# EasyEDA Pro project ProPrj_FYP_Final_Rigid.epro

# Schematic RC_LPF
Board Name: RC_LPF; Create Date: 2026-06-03; Page Name: P1; Project Name: FYP_Final_Rigid; Schematic Name: RC_LPF; Update Date: 2026-06-03; Company: EasyEDA.com; Page Size: A4; Version: V1.0
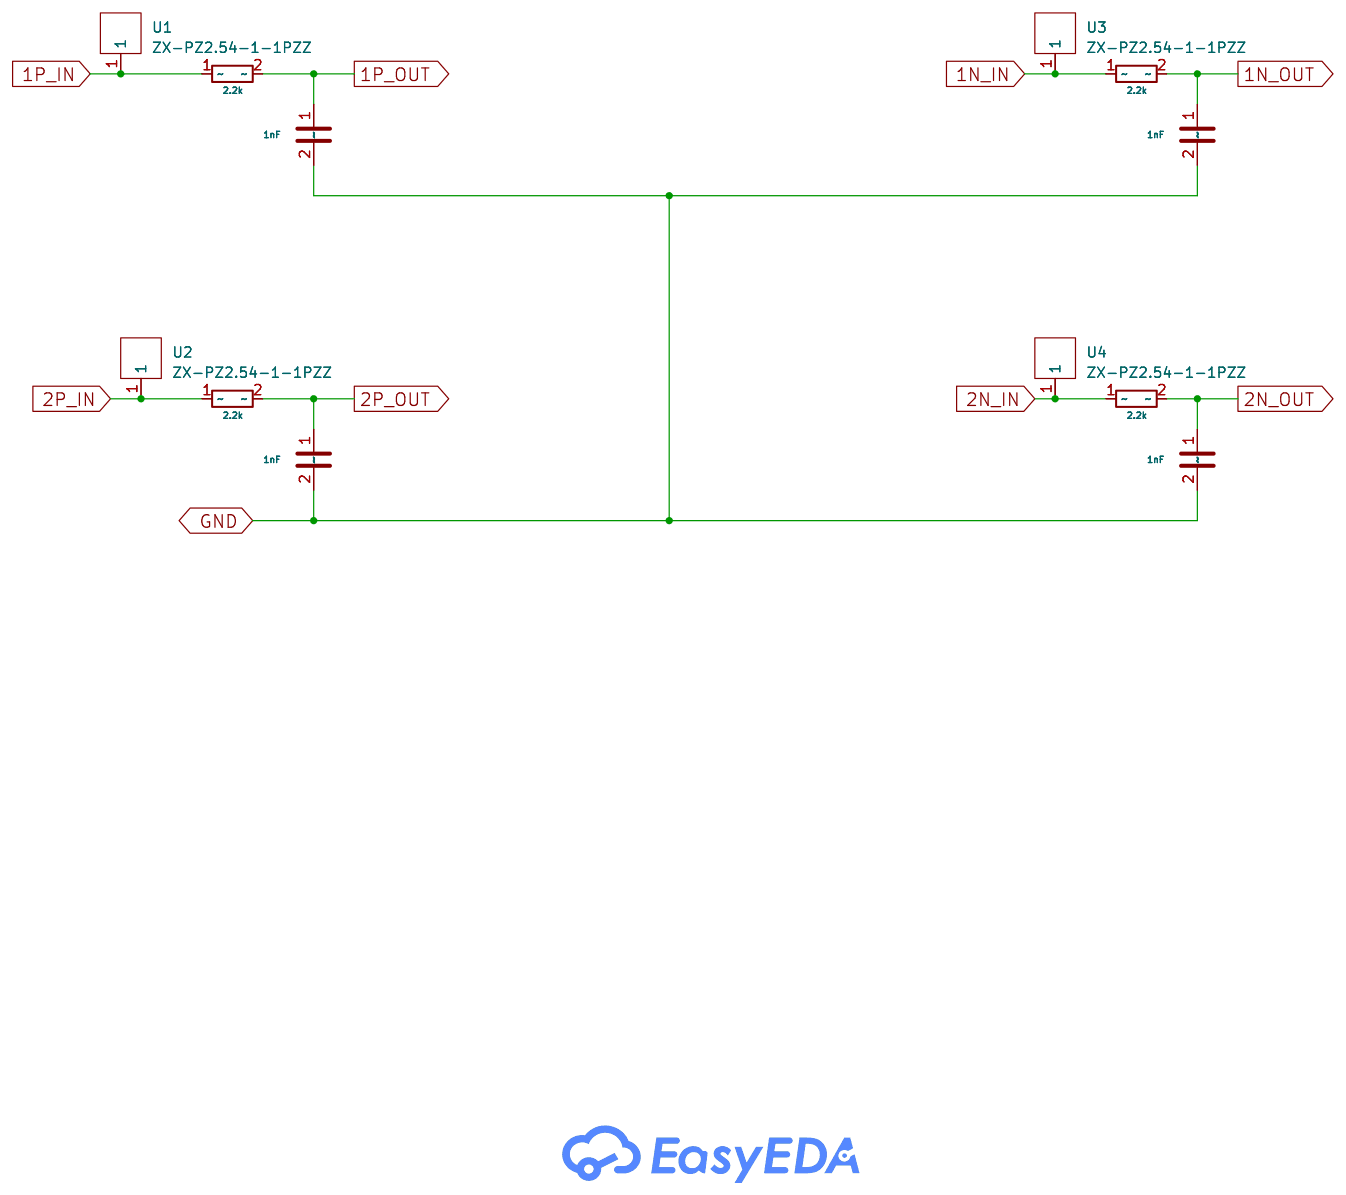
[diagram p0: schematic sheet]

## Parts
C24  1nF  [Capacitor_SMD:C_0805_2012Metric]
C25  1nF  [Capacitor_SMD:C_0805_2012Metric]
C26  1nF  [Capacitor_SMD:C_0805_2012Metric]
C27  1nF  [Capacitor_SMD:C_0805_2012Metric]
R27  2.2k  [R0402]
R34  2.2k  [R0402]
R35  2.2k  [R0402]
R36  2.2k  [R0402]
U1  ZX-PZ2.54-1-1PZZ  [HDR-TH_1P-P2.54-V-M]
U2  ZX-PZ2.54-1-1PZZ  [HDR-TH_1P-P2.54-V-M]
U3  ZX-PZ2.54-1-1PZZ  [HDR-TH_1P-P2.54-V-M]
U4  ZX-PZ2.54-1-1PZZ  [HDR-TH_1P-P2.54-V-M]

## Library data of the parts
C24-C27 = Device_C: Attribute1: C3
R27 R34-R36 = Device_R: Attribute1: R16
U1-U4 = ZX-PZ2.54-1-1PZZ: Pin Structure:1x1P Pitch:2.54mm Row Spacing:- Circluar Pins/Square Pins:Pin Header Mounting Type:Through Hole Number of Rows:1 Number of Pins:1P Current Rating:3A Voltage Rating (Max):- Length of Mating Pin:6mm Insulation Height:2.5mm Length of End Connec; LCSC Part Name: 1x1P 间距:2.54mm 方针 直插; Supplier Part: C7501259; Manufacturer: Megastar(兆星); Supplier Footprint: 插件,P=2.54mm; JLCPCB Part Class: Extended Part; Datasheet: https://item.szlcsc.com/datasheet/ZX-PZ2.54-1-1PZZ/8582472.html; Supplier: LCSC; Pin Structure: 1x1P; Pitch: 2.54mm; Circluar Pins/Square Pins: Pin Header; Mounting Type: Through Hole; Number of Rows: 1; Number of Pins: 1P; Current Rating: 3A; Length of Mating Pin: 6mm; Insulation Height: 2.5mm; Length of End Connection Pin: 3mm; Contact Material: Brass; Contact Plating: Gold; Operating Temperature: -40℃~+105℃; Color: Black

## Nets
GND: C24.2 C25.2 C26.2 C27.2
1N_IN: R34.1 U3.1
1N_OUT: C25.1 R34.2
1P_IN: R27.1 U1.1
1P_OUT: C24.1 R27.2
2N_IN: R36.1 U4.1
2N_OUT: C27.1 R36.2
2P_IN: R35.1 U2.1
2P_OUT: C26.1 R35.2

# Schematic Schematic1
Board Name: Board1; Create Date: 2026-06-03; Page Name: Main; Project Name: FYP_Final_Rigid; Schematic Name: Schematic1; Update Date: 2026-06-03; Company: EasyEDA.com; Page Size: A4; Version: V1.0
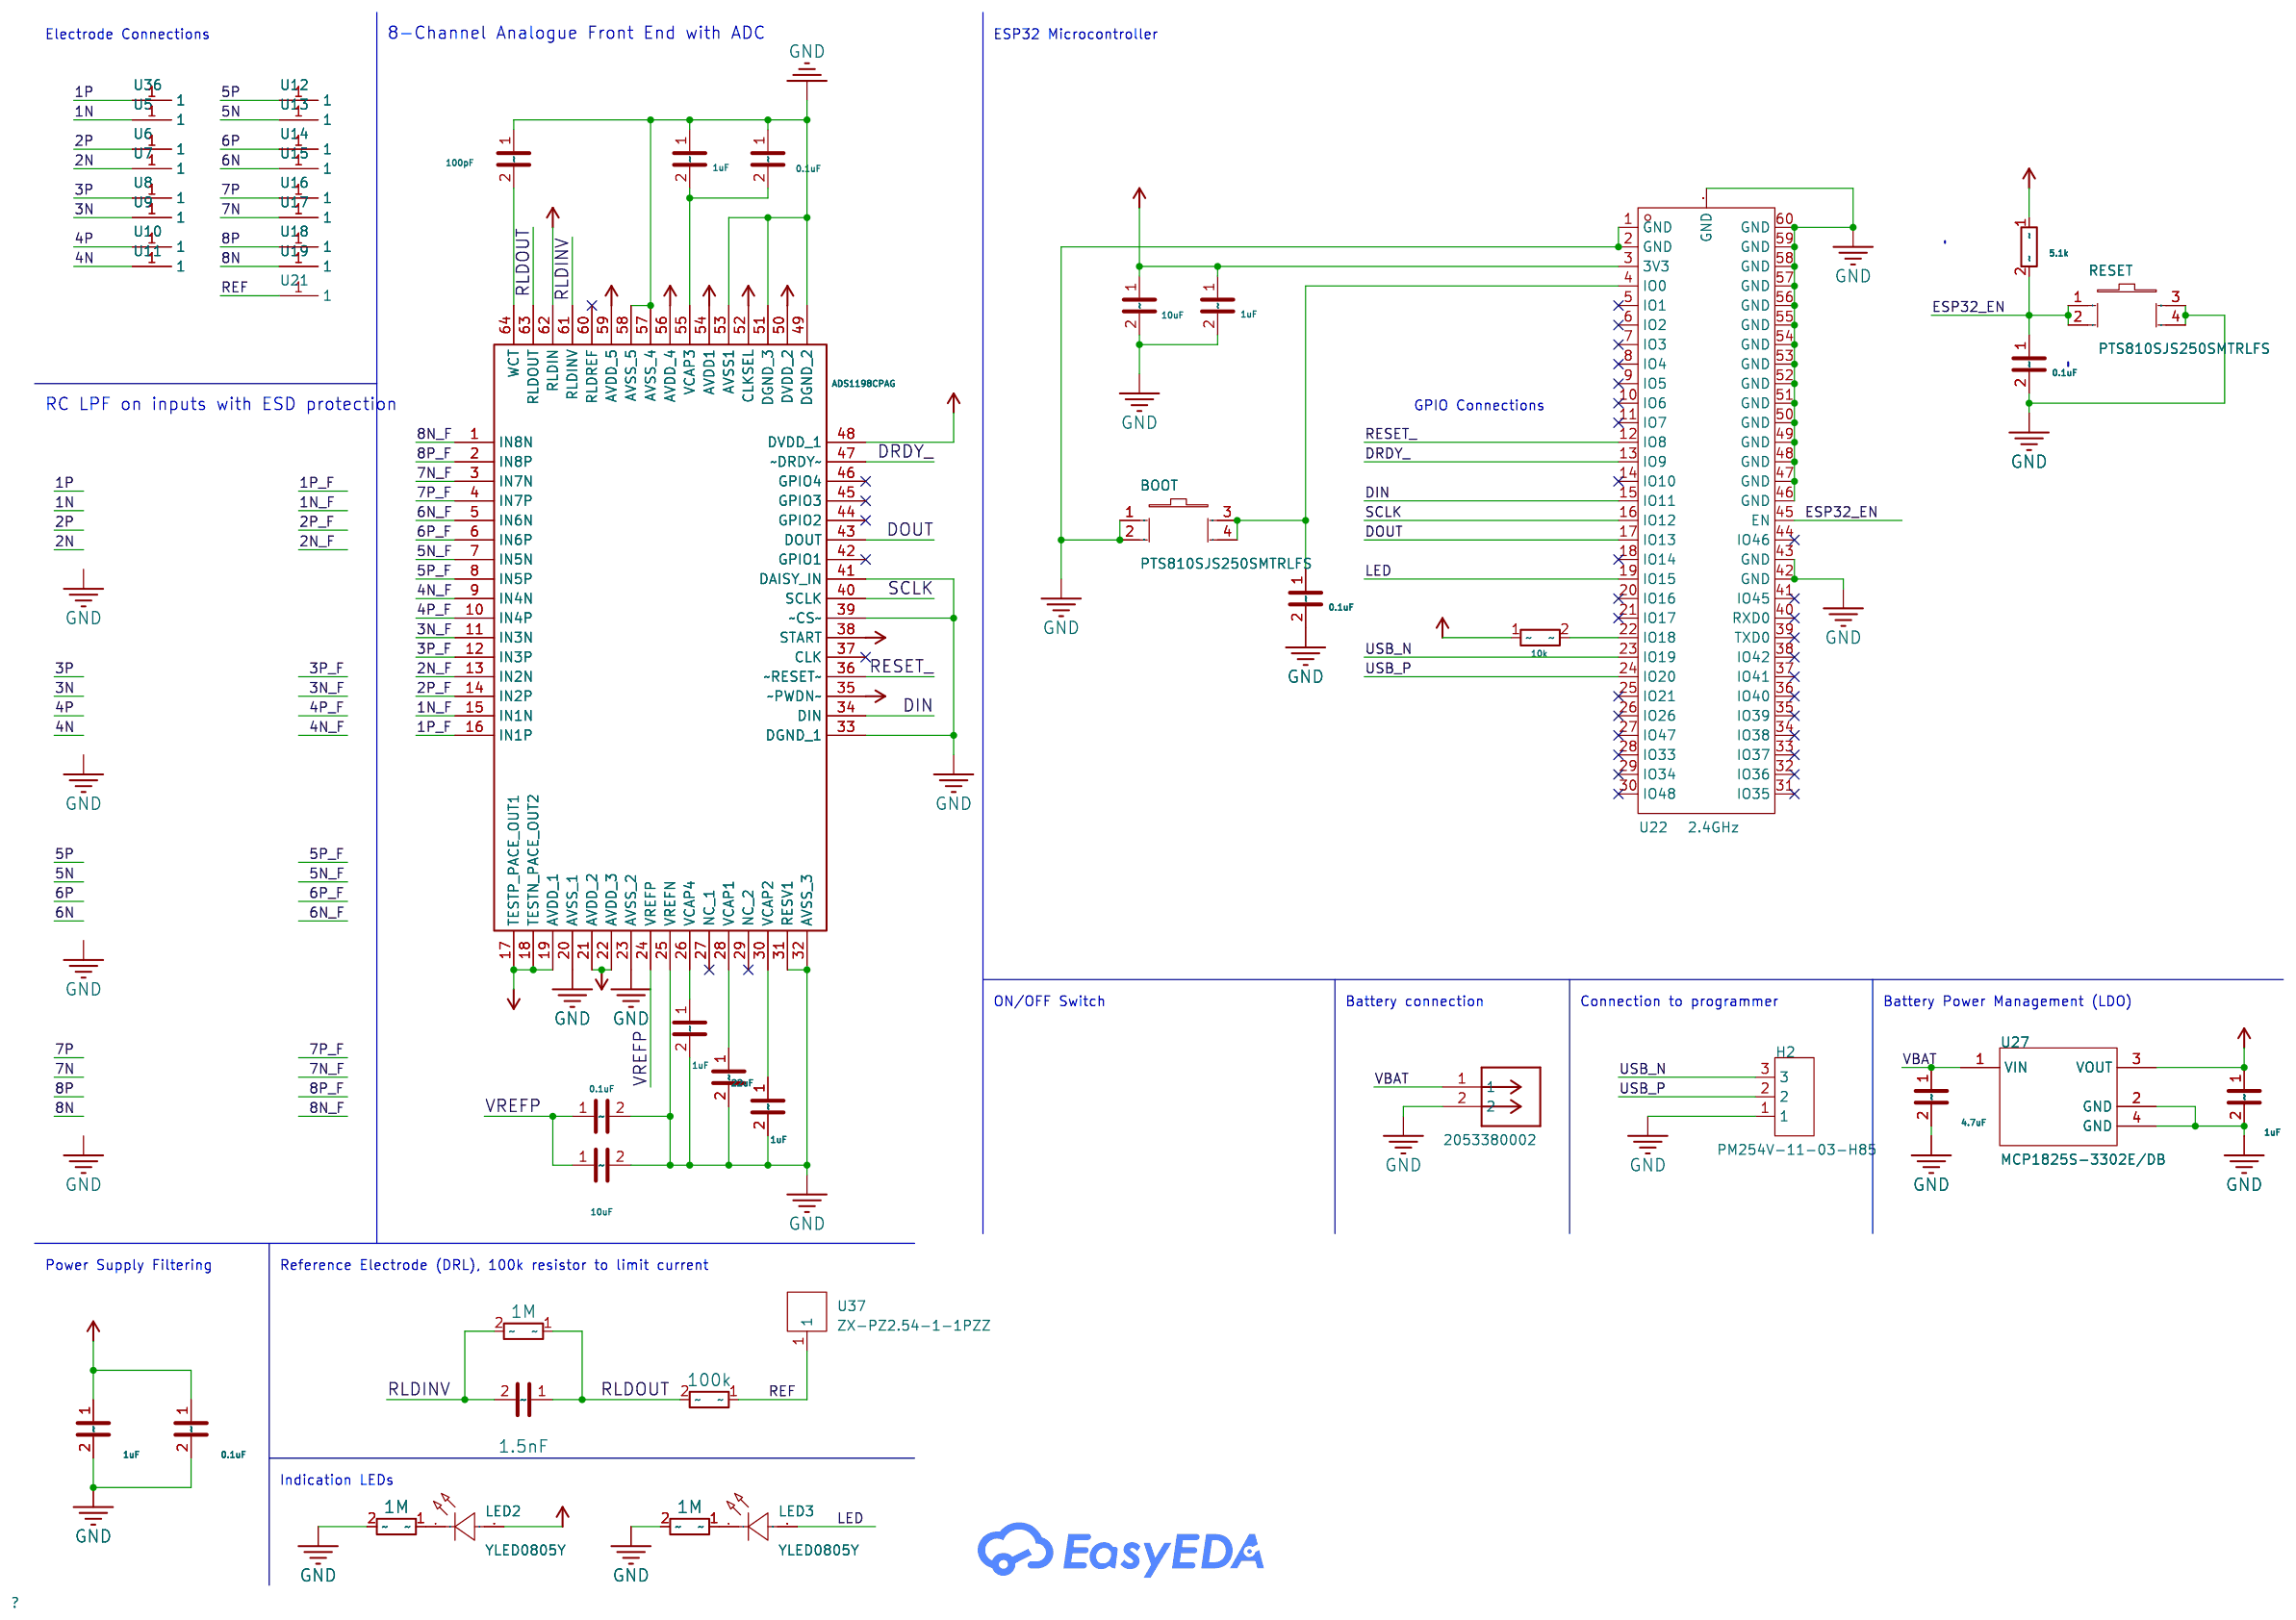
[diagram p1: schematic sheet]

## Parts
BOOT  PTS810SJS250SMTRLFS  [SW-SMD_4P_PTS810SJM250SMTRLFS]
C3  1uF  [Capacitor_SMD:C_0805_2012Metric]
C5  1.5nF  [Capacitor_SMD:C_0805_2012Metric]
C6  100pF  [Capacitor_SMD:C_0805_2012Metric]
C7  0.1uF  [Capacitor_SMD:C_0805_2012Metric]
C8  10uF  [Capacitor_SMD:C_0805_2012Metric]
C9  1uF  [Capacitor_SMD:C_0805_2012Metric]
C10  1uF  [Capacitor_SMD:C_0805_2012Metric]
C11  22uF  [Capacitor_SMD:C_0805_2012Metric]
C12  1uF  [Capacitor_SMD:C_0805_2012Metric]
C18  0.1uF  [Capacitor_SMD:C_0805_2012Metric]
C20  0.1uF  [Capacitor_SMD:C_0805_2012Metric]
C22  0.1uF  [Capacitor_SMD:C_0805_2012Metric]
C23  10uF  [Capacitor_SMD:C_0805_2012Metric]
C28  1uF  [Capacitor_SMD:C_0805_2012Metric]
C29  0.1uF  [Capacitor_SMD:C_0805_2012Metric]
C35  1uF  [Capacitor_SMD:C_0805_2012Metric]
C36  4.7uF  [Capacitor_SMD:C_0805_2012Metric]
CBB1  -
CBB2  -
CBB3  -
CBB4  -
H2  PM254V-11-03-H85  [HDR-TH_3P-P2.54-V-F]
IC2  ADS1198CPAG  [ADS1198CPAG:QFP50P1200X1200X120-64N]
LED2  YLED0805Y  [LED0805-RD_YELLOW]
LED3  YLED0805Y  [LED0805-RD_YELLOW]
R7  1M  [Resistor_SMD:R_0805_2012Metric]
R22  5.1k  [Resistor_SMD:R_0805_2012Metric]
R26  10k  [Resistor_SMD:R_0805_2012Metric]
R37  100k  [Resistor_SMD:R_0805_2012Metric]
R42  1M  [Resistor_SMD:R_0805_2012Metric]
R44  1M  [Resistor_SMD:R_0805_2012Metric]
RESET  PTS810SJS250SMTRLFS  [SW-SMD_4P_PTS810SJM250SMTRLFS]
U5  -  [Electrode_Contact]  (no BOM)
U6  -  [Electrode_Contact]  (no BOM)
U7  -  [Electrode_Contact]  (no BOM)
U8  -  [Electrode_Contact]  (no BOM)
U9  -  [Electrode_Contact]  (no BOM)
U10  -  [Electrode_Contact]  (no BOM)
U11  -  [Electrode_Contact]  (no BOM)
U12  -  [Electrode_Contact]  (no BOM)
U13  -  [Electrode_Contact]  (no BOM)
U14  -  [Electrode_Contact]  (no BOM)
U15  -  [Electrode_Contact]  (no BOM)
U16  -  [Electrode_Contact]  (no BOM)
U17  -  [Electrode_Contact]  (no BOM)
U18  -  [Electrode_Contact]  (no BOM)
U19  -  [Electrode_Contact]  (no BOM)
U20  2053380002  [CONN_2053380000-SD_02_MOL]
U21  -  [Electrode_Contact]  (no BOM)
U22  2.4GHz  [BULETM-SMD_ESP32-S3-MINI-1-N8]
U27  MCP1825S-3302E/DB  [SOT-223-3_L6.5-W3.4-P2.30-LS7.0-BR]
U36  -  [Electrode_Contact]  (no BOM)
U37  ZX-PZ2.54-1-1PZZ  [HDR-TH_1P-P2.54-V-M]

## Library data of the parts
BOOT RESET = PTS810SJS250SMTRLFS: Circuit:SPST Actuator Style:Round Button Operating Force:6N Mounting Type:Surface Mount,Vertical Length:4.2mm Width:3.2mm Switch Height:2.5mm Contact Current:50mA Voltage Rating:16V With Lamp:- Termination Style:J-Lead Life:- Operating Temperature:-40℃~+8; LCSC Part Name: 轻触开关4.2mm*3.2mm，600gf; Supplier Part: C221897; Manufacturer: C&K; Supplier Footprint: SMD-4P,3.2x4.2mm; JLCPCB Part Class: Extended Part; Datasheet: https://item.szlcsc.com/datasheet/PTS810SJS250SMTRLFS/222327.html; Supplier: LCSC; Circuit: SPST; Actuator Style: Round Button; Operating Force: 6N; Mounting Type: Surface Mount,Vertical; Length: 4.2mm; Width: 3.2mm; Switch Height: 2.5mm; Contact Current: 50mA; Voltage Rating: 16V; Termination Style: J-Lead; Operating Temperature: -40℃~+85℃
C3 = Device_C
C5-C12 C20 C22 C28 C29 C35 C36 = Device_C: Attribute1: C3
C18 C23 = Device_C: Unpolarized capacitor; Attribute1: C3
H2 = PM254V-11-03-H85: Holes Structure:1x3P Pitch:2.54mm Row Spacing:- Circular Hole / Square Hole:Square Hole Mounting Type:Through Hole Number of Rows:1 Number of Positions:3P Current Rating:3A Holes Direction:Top Insulation Height:8.5mm Contact Material:Brass Contact Plating; LCSC Part Name: 1x3P 间距:2.54mm 直插; Supplier Part: C541850; Manufacturer: XFCN(兴飞); Supplier Footprint: 插件,P=2.54mm; JLCPCB Part Class: Extended Part; Datasheet: https://item.szlcsc.com/datasheet/PM254V-11-03-H85/562471.html; Supplier: LCSC; Holes Structure: 1x3P; Pitch: 2.54mm; Circular Hole / Square Hole: Square Hole; Mounting Type: Through Hole; Number of Rows: 1; Number of Positions: 3P; Current Rating: 3A; Holes Direction: Top; Insulation Height: 8.5mm; Contact Material: Brass; Operating Temperature: -40℃~+105℃
IC2 = ADS1198CPAG_ADS1198CPAG: Low-Noise, 8 Channel, 16 Bit Analog Front End for ECG/EEG Measurements; Datasheet: http://www.ti.com/lit/gpn/ads1198; Height: 1.2; Mouser Part Number: 595-ADS1198CPAG; Mouser Price/Stock: https://www.mouser.co.uk/ProductDetail/Texas-Instruments/ADS1198CPAG?qs=kdXDfQWUdfeQh%252BqZGyXmmw%3D%3D; Manufacturer_Name: Texas Instruments; User doc link: http://www.ti.com/lit/gpn/ads1198
LED2 LED3 = YLED0805Y: Lamp Holder Type:- Illumination Color:Yellow Voltage - Forward(Vf):1.8V~2.4V Voltage - Forward(Vf):1.8V~2.4V Power(Watts):60mW Forward Current:20mA Wavelength - Dominant:584nm~596nm Wavelength - Dominant:584nm~596nm Peak Wavelength:598nm Peak Wavelength:5; LCSC Part Name: 发光管; Supplier Part: C20608785; Manufacturer: YONGYUTAI(永裕泰); Supplier Footprint: 0805; JLCPCB Part Class: Extended Part; Datasheet: https://item.szlcsc.com/datasheet/YLED0805Y/21958292.html; Supplier: LCSC; Illumination Color: Yellow; Voltage - Forward(Vf): 1.8V~2.4V; Power(Watts): 60mW; Forward Current: 20mA; Wavelength - Dominant: 584nm~596nm; Peak Wavelength: 598nm; Diode Configuration: Discrete Diode; Lens Color: Water Clear; Luminous Intensity: 210mcd; Viewing Angle: 120°; Operating Temperature: -40℃~+85℃
R7 R22 R26 R37 R42 R44 = Device_R: Attribute1: R16
U5-U19 U21 U36 = electrode-contact
U20 = 2053380002
U22 = ESP32-S3-MINI-1-N8: Utilized IC / Part:ESP32-S3FN8 Chip Wireless Standard:Bluetooth5.0 Interface Type:SPI；I2S；USB；I2C；UART Frequency:2.4GHz Antenna Type:On-board PCB Antenna Output Power:20.5dBm Output Power:20.5dBm Voltage - Supply:3V~3.6V Voltage - Supply:3V~3.6V Receive; LCSC Part Name: 不带固件 小尺寸模组，集成2.4GHz Wi-Fi(802.11b/g/n)+Bluetooth 5(LE); Supplier Part: C2913206; Manufacturer: ESPRESSIF(乐鑫); Supplier Footprint: SMD; JLCPCB Part Class: Extended Part; Datasheet: https://item.szlcsc.com/datasheet/ESP32-S3-MINI-1-N8/3198304.html; Supplier: LCSC; Utilized IC / Part: ESP32-S3FN8 Chip; Wireless Standard: Bluetooth5.0; Interface Type: SPI；I2S；USB；I2C；UART; Antenna Type: On-board PCB Antenna; Output Power: 20.5dBm; Voltage - Supply: 3V~3.6V; Receive  Current: 97mA; Send  Current: 330mA; Sensitivity: -104.5dBm; Operating Temperature: -40℃~+85℃
U27 = MCP1825S-3302E/DB: Output Type:Fixed Voltage - Supply:6V Output Voltage:3.3V Output Voltage:3.3V Output Current:500mA Power Supply Rejection Ratio (PSRR):60dB@(100Hz) Voltage Dropout:210mV@(500mA) standby current:120uA Features:Short Circuit Protection；Over Temperature Prot; LCSC Part Name: 输入6V 输出3.3V 500mA; Supplier Part: C148031; Manufacturer: MICROCHIP(美国微芯); Supplier Footprint: SOT-223-3; JLCPCB Part Class: Extended Part; Datasheet: https://item.szlcsc.com/datasheet/MCP1825S-3302E%252FDB/159364.html; Supplier: LCSC; Output Type: Fixed; Voltage - Supply: 6V; Output Voltage: 3.3V; Output Current: 500mA; Power Supply Rejection Ratio (PSRR): 60dB@(100Hz); Voltage Dropout: 210mV@(500mA); standby current: 120uA; Features: Short Circuit Protection；Over Temperature Protection；Over Current Protection；Under Voltage Lockout; Operating Temperature: -40℃~+125℃@(Tj); Output Configuration: Positive; Number of Outputs: 1
U37 = ZX-PZ2.54-1-1PZZ: Pin Structure:1x1P Pitch:2.54mm Row Spacing:- Circluar Pins/Square Pins:Pin Header Mounting Type:Through Hole Number of Rows:1 Number of Pins:1P Current Rating:3A Voltage Rating (Max):- Length of Mating Pin:6mm Insulation Height:2.5mm Length of End Connec; LCSC Part Name: 1x1P 间距:2.54mm 方针 直插; Supplier Part: C7501259; Manufacturer: Megastar(兆星); Supplier Footprint: 插件,P=2.54mm; JLCPCB Part Class: Extended Part; Datasheet: https://item.szlcsc.com/datasheet/ZX-PZ2.54-1-1PZZ/8582472.html; Supplier: LCSC; Pin Structure: 1x1P; Pitch: 2.54mm; Circluar Pins/Square Pins: Pin Header; Mounting Type: Through Hole; Number of Rows: 1; Number of Pins: 1P; Current Rating: 3A; Length of Mating Pin: 6mm; Insulation Height: 2.5mm; Length of End Connection Pin: 3mm; Contact Material: Brass; Contact Plating: Gold; Operating Temperature: -40℃~+105℃; Color: Black

## Nets
GND: BOOT.1 BOOT.2 C3.2 C6.1 C7.2 C8.2 C9.1 C10.2 C11.2 C12.2 C18.1 C20.2 C22.2 C23.2 C28.2 C29.2 C35.2 C36.2 CBB1.5(GND) CBB2.5(GND) CBB3.5(GND) CBB4.5(GND) H2.1 IC2.20(AVSS_1) IC2.23(AVSS_2) IC2.25(VREFN) IC2.31(RESV1) IC2.32(AVSS_3) IC2.33(DGND_1) IC2.39(~CS~) IC2.41(DAISY_IN) IC2.49(DGND_2) IC2.51(DGND_3) IC2.53(AVSS1) IC2.57(AVSS_4) IC2.58(AVSS_5) R42.2 R44.2 RESET.3 RESET.4 U20.2 U22.1(GND) U22.2(GND) U22.42(GND) U22.43(GND) U22.46(GND) U22.47(GND) U22.48(GND) U22.49(GND) U22.50(GND) U22.51(GND) U22.52(GND) U22.53(GND) U22.54(GND) U22.55(GND) U22.56(GND) U22.57(GND) U22.58(GND) U22.59(GND) U22.60(GND) U22.GND U27.2(GND) U27.4(GND)
VBAT: C36.1 U20.1 U27.1(VIN)
1N: CBB1.2(1N_IN) U5.1
1N_F: CBB1.8(1N_OUT) IC2.15(IN1N)
1P: CBB1.1(1P_IN) U36.1
1P_F: CBB1.9(1P_OUT) IC2.16(IN1P)
2N: CBB1.4(2N_IN) U7.1
2N_F: CBB1.6(2N_OUT) IC2.13(IN2N)
2P: CBB1.3(2P_IN) U6.1
2P_F: CBB1.7(2P_OUT) IC2.14(IN2P)
3N: CBB2.2(1N_IN) U9.1
3N_F: CBB2.8(1N_OUT) IC2.11(IN3N)
3P: CBB2.1(1P_IN) U8.1
3P_F: CBB2.9(1P_OUT) IC2.12(IN3P)
4N: CBB2.4(2N_IN) U11.1
4N_F: CBB2.6(2N_OUT) IC2.9(IN4N)
4P: CBB2.3(2P_IN) U10.1
4P_F: CBB2.7(2P_OUT) IC2.10(IN4P)
5N: CBB3.2(1N_IN) U13.1
5N_F: CBB3.8(1N_OUT) IC2.7(IN5N)
5P: CBB3.1(1P_IN) U12.1
5P_F: CBB3.9(1P_OUT) IC2.8(IN5P)
6N: CBB3.4(2N_IN) U15.1
6N_F: CBB3.6(2N_OUT) IC2.5(IN6N)
6P: CBB3.3(2P_IN) U14.1
6P_F: CBB3.7(2P_OUT) IC2.6(IN6P)
7N: CBB4.2(1N_IN) U17.1
7N_F: CBB4.8(1N_OUT) IC2.3(IN7N)
7P: CBB4.1(1P_IN) U16.1
7P_F: CBB4.9(1P_OUT) IC2.4(IN7P)
8N: CBB4.4(2N_IN) U19.1
8N_F: CBB4.6(2N_OUT) IC2.1(IN8N)
8P: CBB4.3(2P_IN) U18.1
8P_F: CBB4.7(2P_OUT) IC2.2(IN8P)
DIN: IC2.34(DIN) U22.15(IO11)
DOUT: IC2.43(DOUT) U22.17(IO13)
DRDY_: IC2.47(~DRDY~) U22.13(IO9)
ESP32_EN: C20.1 R22.2 RESET.1 RESET.2 U22.45(EN)
LED: LED3.2(A) U22.19(IO15)
POWER_+3.3V: C3.1 C23.1 C28.1 C29.1 C35.1 IC2.17(TESTP_PACE_OUT1) IC2.18(TESTN_PACE_OUT2) IC2.19(AVDD_1) IC2.21(AVDD_2) IC2.22(AVDD_3) IC2.35(~PWDN~) IC2.38(START) IC2.48(DVDD_1) IC2.50(DVDD_2) IC2.52(CLKSEL) IC2.54(AVDD1) IC2.56(AVDD_4) IC2.59(AVDD_5) IC2.62(RLDIN) LED2.2(A) R22.1 R26.1 U22.3(3V3) U27.3(VOUT)
REF: R37.1 U21.1 U37.1
RESET_: IC2.36(~RESET~) U22.12(IO8)
RLDINV: C5.2 IC2.61(RLDINV) R7.2
RLDOUT: C5.1 IC2.63(RLDOUT) R7.1 R37.2
SCLK: IC2.40(SCLK) U22.16(IO12)
USB_N: H2.3 U22.23(IO19)
USB_P: H2.2 U22.24(IO20)
VREFP: C7.1 C8.1 IC2.24(VREFP)
$1N2733: C12.1 IC2.30(VCAP2)
$1N2742: C11.1 IC2.28(VCAP1)
$1N2744: C9.2 C18.2 IC2.55(VCAP3)
$1N2800: C6.2 IC2.64(WCT)
$1N2847: C10.1 IC2.26(VCAP4)
$1N15781: BOOT.3 BOOT.4 C22.1 U22.4(IO0)
$1N16915: R26.2 U22.22(IO18)
$1N37471: LED3.1(K) R42.1
$1N37498: LED2.1(K) R44.1

Not connected (* = marked no-connect by the designer): IC2 27(NC_1)* 29(NC_2)* 37(CLK)* 42(GPIO1)* 44(GPIO2)* 45(GPIO3)* 46(GPIO4)* 60(RLDREF)*; U22 5(IO1)* 6(IO2)* 7(IO3)* 8(IO4)* 9(IO5)* 10(IO6)* 11(IO7)* 14(IO10)* 18(IO14)* 20(IO16)* 21(IO17)* 25(IO21)* 26(IO26)* 27(IO47)* 28(IO33)* 29(IO34)* 30(IO48)* 31(IO35)* 32(IO36)* 33(IO37)* 34(IO38)* 35(IO39)* 36(IO40)* 37(IO41)* 38(IO42)* 39(TXD0)* 40(RXD0)* 41(IO45)* 44(IO46)*

## Notes on the sheet
- Electrode Connections
- 8-Channel Analogue Front End with ADC
- ESP32 Microcontroller
- RC LPF on inputs with ESD protection
- GPIO Connections
- ON/OFF Switch
- Battery connection
- Connection to programmer
- Battery Power Management (LDO)
- Power Supply Filtering
- Reference Electrode (DRL), 100k resistor to limit current
- Indication LEDs

# Board PCB1
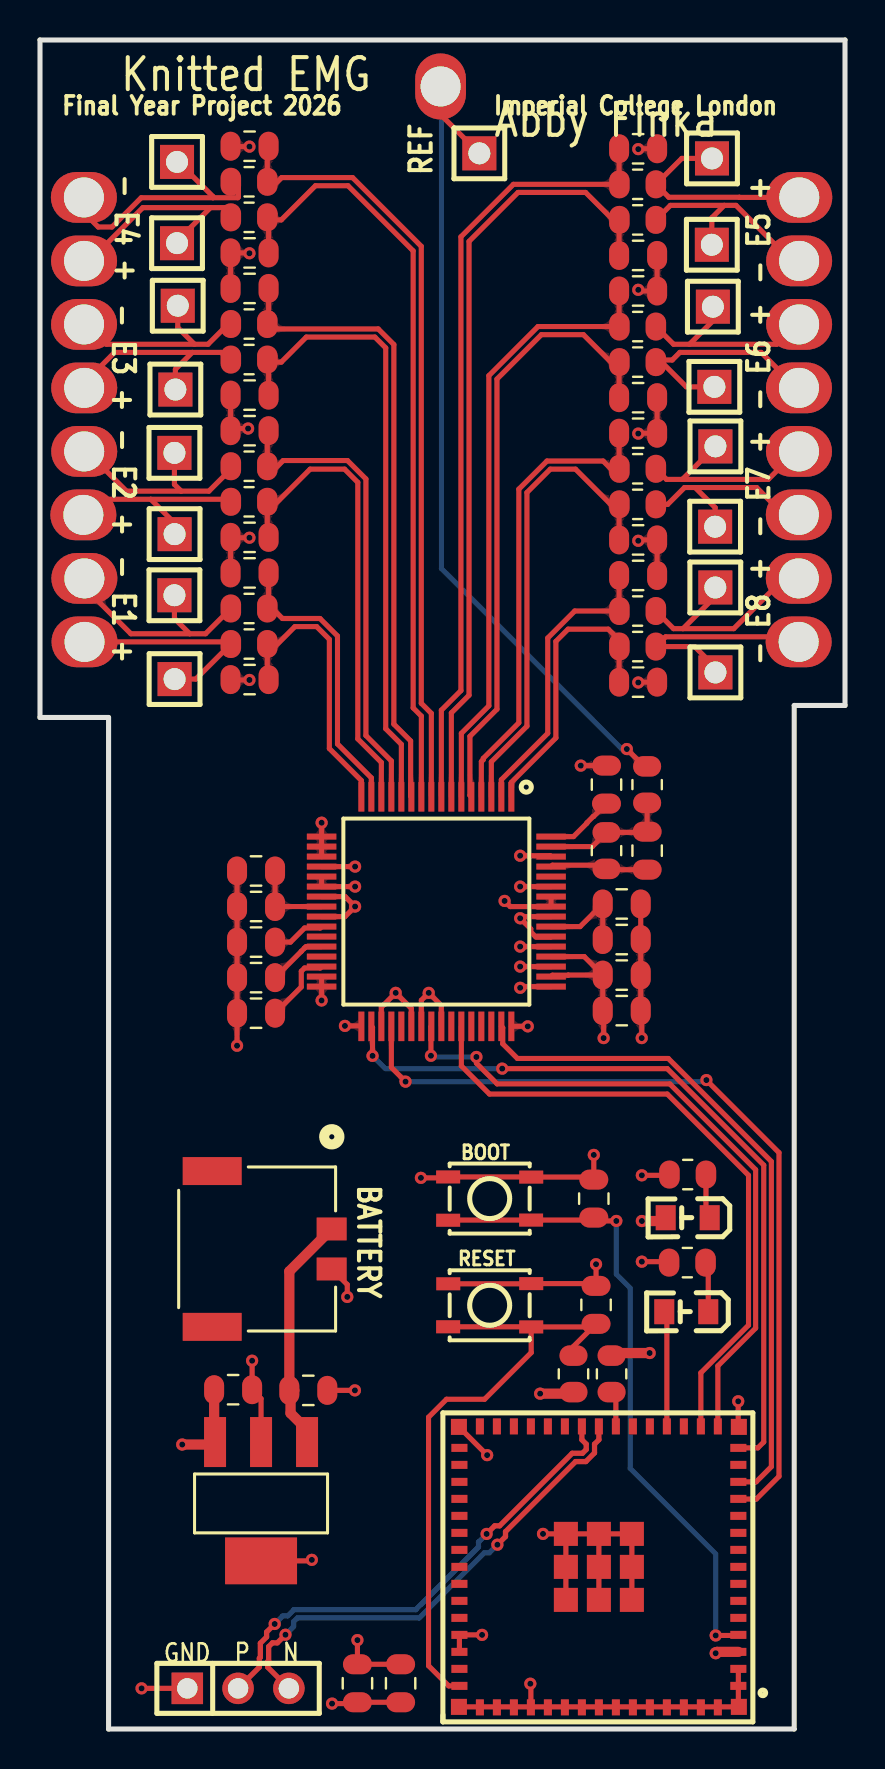
[diagram p2: board, top side]
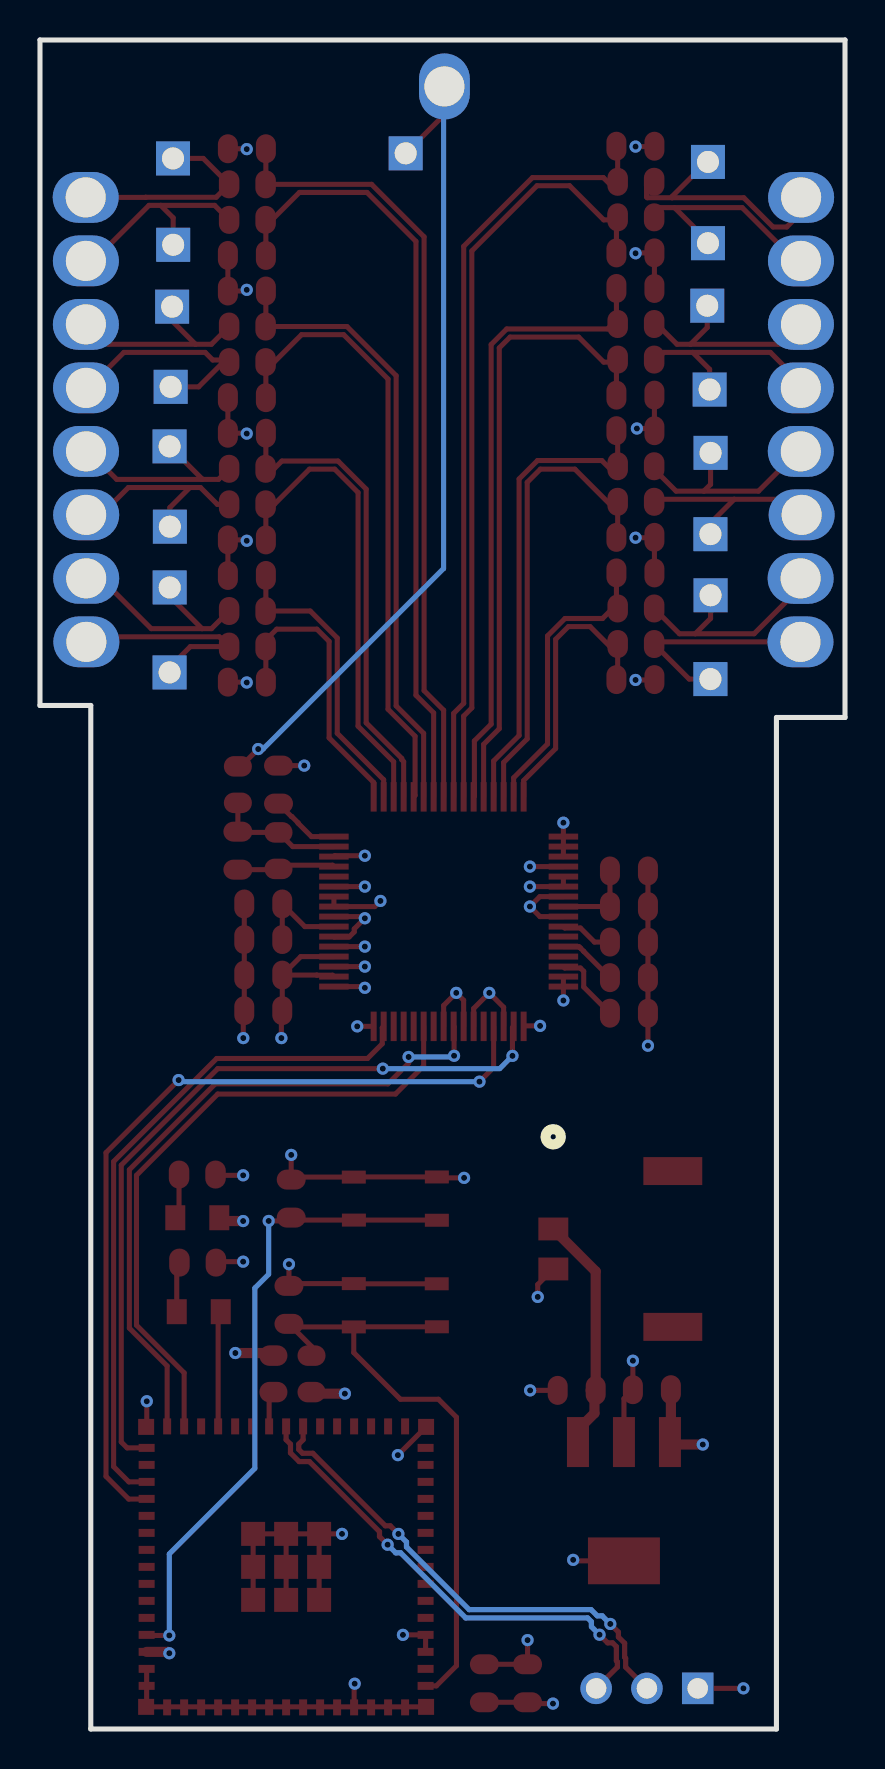
[diagram p3: board, bottom side, seen from below]

Outline 40.26 x 84.45 mm; copper layers: Top Layer, Inner1, Inner2, Bottom Layer. Coordinates in mm from the lower left corner of the outline.
Outline path: 0,84.45 40.26,84.45 40.26,51.18 37.72,51.18 37.72,0 3.43,0 3.43,50.58 0,50.58 0,84.45
Stack: Top Layer 0.035mm Outer layer thickness 1oz / Dielectric1 0.2104mm 7628 RC49% 8.6mil / Inner1 0.0152mm Inner layer thickness / Dielectric2 1.065mm 1.1mm H/HOZ Copper / Inner2 0.0152mm Inner layer thickness / Dielectric3 0.2104mm 7628 RC49% 8.6mil / Bottom Layer 0.035mm Outer layer thickness 1oz

## Design rules (mm)
net 3P_F: DP3
net 3N_F: DP3
net 4P_F: DP4
net 4N_F: DP4
net 5P_F: DP5
net 5N_F: DP5
net 6P_F: DP6
net 6N_F: DP6
net 7P_F: DP7
net 7N_F: DP7
net 1P_F: DP1
net 1N_F: DP1
net 2P_F: DP2
net 2N_F: DP2
net 8P_F: DP8
net 8N_F: DP8
net 1P: 1
net 2P: 2
net 2N: 2
net 1N: 1
net 3P: 3
net 4P: 4
net 4N: 4
net 3N: 3
net 5P: 5
net 6P: 6
net 6N: 6
net 5N: 5
net 7P: 7
net 8P: 8
net 8N: 8
net 7N: 7
net USB_N: USB_
net USB_P: USB_
template: Custom Config
spacing copperThickness1oz (default): track to track 0.102, other pairs 0.152 to 0.3
spacing copperThickness2oz: track to track 0.203, other pairs 0.152 to 0.3
spacing copperThicknessInner0.5oz: track to track 0.089, other pairs 0.152 to 0.3
track width copperThickness1oz (default): min 0.102, default 0.254, max 2.54
track width copperThickness2oz: min 0.203, default 0.254, max 2.54
track width copperThickness0.5oz: min 0.089, default 0.254, max 2.54
differential pair differentialPair (default): width min 0.127, default 0.254, max 2.54; gap min 0.152, default 0.152
differential pair USB: width min 0.261, default 0.261, max 0.261; gap min 0.152, default 0.152
via viaSize (default): diameter min 0.3, default 0.61, max 10; hole min 0.2, default 0.305, max 6.3
diff pair USB_ uses USB

## Placement (name value [footprint] x y rotation side)
BOOT  PTS810SJS250SMTRLFS  [SW-SMD_4P_PTS810SJM250SMTRLFS]  22.49 26.52 0 top
C1  -  [Capacitor_SMD:C_0805_2012Metric]  10.48 66.7 180 top
C2  -  [Capacitor_SMD:C_0805_2012Metric]  10.48 72.03 180 top
C3  1uF  [Capacitor_SMD:C_0805_2012Metric]  15.88 2.29 270 top
C4  -  [Capacitor_SMD:C_0805_2012Metric]  10.48 73.81 180 top
C5  1.5nF  [Capacitor_SMD:C_0805_2012Metric]  30.36 43.92 270 top
C6  100pF  [Capacitor_SMD:C_0805_2012Metric]  28.33 47.22 270 top
C7  0.1uF  [Capacitor_SMD:C_0805_2012Metric]  10.8 42.9 180 top
C8  10uF  [Capacitor_SMD:C_0805_2012Metric]  10.8 41.13 180 top
C9  1uF  [Capacitor_SMD:C_0805_2012Metric]  29.09 41.25 180 top
C10  1uF  [Capacitor_SMD:C_0805_2012Metric]  10.8 39.35 180 top
C11  22uF  [Capacitor_SMD:C_0805_2012Metric]  10.8 37.57 180 top
C12  1uF  [Capacitor_SMD:C_0805_2012Metric]  10.8 35.79 180 top
C13  -  [Capacitor_SMD:C_0805_2012Metric]  10.48 79.14 180 top
C14  -  [Capacitor_SMD:C_0805_2012Metric]  29.91 79.02 0 top
C15  -  [Capacitor_SMD:C_0805_2012Metric]  29.91 73.68 0 top
C16  -  [Capacitor_SMD:C_0805_2012Metric]  29.91 71.9 0 top
C17  -  [Capacitor_SMD:C_0805_2012Metric]  29.91 66.57 0 top
C18  0.1uF  [Capacitor_SMD:C_0805_2012Metric]  29.09 39.48 180 top
C19  -  [Capacitor_SMD:C_0805_2012Metric]  29.91 64.79 0 top
C20  0.1uF  [Capacitor_SMD:C_0805_2012Metric]  27.81 21.21 90 top
C21  -  [Capacitor_SMD:C_0805_2012Metric]  29.91 59.46 0 top
C22  0.1uF  [Capacitor_SMD:C_0805_2012Metric]  27.7 26.52 90 top
C23  10uF  [Capacitor_SMD:C_0805_2012Metric]  18.03 2.29 270 top
C24  -  [Capacitor_SMD:C_0805_2012Metric]  10.48 52.47 180 top
C25  -  [Capacitor_SMD:C_0805_2012Metric]  10.48 57.81 180 top
C26  -  [Capacitor_SMD:C_0805_2012Metric]  10.48 59.59 180 top
C27  -  [Capacitor_SMD:C_0805_2012Metric]  10.48 64.92 180 top
C28  1uF  [Capacitor_SMD:C_0805_2012Metric]  29.09 37.7 0 top
C29  0.1uF  [Capacitor_SMD:C_0805_2012Metric]  29.09 35.92 0 top
C31  -  [Capacitor_SMD:C_0805_2012Metric]  29.91 57.68 0 top
C32  -  [Capacitor_SMD:C_0805_2012Metric]  29.91 52.35 0 top
C35  1uF  [Capacitor_SMD:C_0805_2012Metric]  9.66 16.97 0 top
C36  4.7uF  [Capacitor_SMD:C_0805_2012Metric]  13.42 16.93 0 top
H2  PM254V-11-03-H85  [HDR-TH_3P-P2.54-V-F]  9.91 2.03 0 top
IC2  ADS1198CPAG  [ADS1198CPAG:QFP50P1200X1200X120-64N]  19.82 40.87 270 top
LED2  YLED0805Y  [LED0805-RD_YELLOW]  32.39 25.56 180 top
LED3  YLED0805Y  [LED0805-RD_YELLOW]  32.32 20.87 180 top
R1  -  [Resistor_SMD:R_0805_2012Metric]  10.46 54.25 0 top
R2  -  [Resistor_SMD:R_0805_2012Metric]  10.46 68.48 0 top
R3  -  [Resistor_SMD:R_0805_2012Metric]  10.46 70.25 0 top
R4  -  [Resistor_SMD:R_0805_2012Metric]  10.46 75.59 0 top
R5  -  [Resistor_SMD:R_0805_2012Metric]  10.46 77.37 0 top
R6  -  [Resistor_SMD:R_0805_2012Metric]  29.89 77.24 180 top
R7  1M  [Resistor_SMD:R_0805_2012Metric]  28.33 43.92 270 top
R8  -  [Resistor_SMD:R_0805_2012Metric]  29.89 75.46 180 top
R9  -  [Resistor_SMD:R_0805_2012Metric]  29.89 70.13 180 top
R10  -  [Resistor_SMD:R_0805_2012Metric]  29.89 68.35 180 top
R11  -  [Resistor_SMD:R_0805_2012Metric]  29.89 63.01 180 top
R12  -  [Resistor_SMD:R_0805_2012Metric]  29.89 61.24 180 top
R13  -  [Resistor_SMD:R_0805_2012Metric]  29.89 55.9 180 top
R14  -  [Resistor_SMD:R_0805_2012Metric]  29.89 54.12 180 top
R22  5.1k  [Resistor_SMD:R_0805_2012Metric]  26.68 17.76 90 top
R26  10k  [Resistor_SMD:R_0805_2012Metric]  28.58 17.76 270 top
R34  -  [Resistor_SMD:R_0805_2012Metric]  10.46 56.03 0 top
R35  -  [Resistor_SMD:R_0805_2012Metric]  10.46 61.36 0 top
R36  -  [Resistor_SMD:R_0805_2012Metric]  10.46 63.14 0 top
R37  100k  [Resistor_SMD:R_0805_2012Metric]  30.36 47.22 270 top
R42  1M  [Resistor_SMD:R_0805_2012Metric]  32.37 23.32 180 top
R44  1M  [Resistor_SMD:R_0805_2012Metric]  32.39 27.72 180 top
RESET  PTS810SJS250SMTRLFS  [SW-SMD_4P_PTS810SJM250SMTRLFS]  22.49 21.19 180 top
U1  ZX-PZ2.54-1-1PZZ  [HDR-TH_1P-P2.54-V-M]  6.73 52.5 0 top
U2  ZX-PZ2.54-1-1PZZ  [HDR-TH_1P-P2.54-V-M]  6.73 59.75 0 top
U3  ZX-PZ2.54-1-1PZZ  [HDR-TH_1P-P2.54-V-M]  6.72 56.69 0 top
U4  ZX-PZ2.54-1-1PZZ  [HDR-TH_1P-P2.54-V-M]  6.72 63.81 0 top
U5  -  [Electrode_Contact]  2.22 57.53 270 top
U6  -  [Electrode_Contact]  2.17 60.71 270 top
U7  -  [Electrode_Contact]  2.21 63.88 270 top
U8  -  [Electrode_Contact]  2.21 67.06 270 top
U9  -  [Electrode_Contact]  2.2 70.23 270 top
U10  -  [Electrode_Contact]  2.2 73.41 270 top
U11  -  [Electrode_Contact]  2.2 76.58 270 top
U12  -  [Electrode_Contact]  37.97 76.58 90 top
U13  -  [Electrode_Contact]  37.96 73.41 90 top
U14  -  [Electrode_Contact]  37.96 70.23 90 top
U15  -  [Electrode_Contact]  37.96 67.06 90 top
U16  -  [Electrode_Contact]  37.96 63.88 90 top
U17  -  [Electrode_Contact]  37.95 60.71 90 top
U18  -  [Electrode_Contact]  37.95 57.53 90 top
U19  -  [Electrode_Contact]  37.94 54.36 90 top
U20  2053380002  [CONN_2053380000-SD_02_MOL]  10.86 24 90 top
U21  -  [Electrode_Contact]  20.03 82.13 180 top
U22  2.4GHz  [BULETM-SMD_ESP32-S3-MINI-1-N8]  27.95 8.11 180 top
U23  ZX-PZ2.54-1-1PZZ  [HDR-TH_1P-P2.54-V-M]  6.77 66.98 0 top
U24  ZX-PZ2.54-1-1PZZ  [HDR-TH_1P-P2.54-V-M]  6.85 74.29 0 top
U25  ZX-PZ2.54-1-1PZZ  [HDR-TH_1P-P2.54-V-M]  6.89 71.17 0 top
U26  ZX-PZ2.54-1-1PZZ  [HDR-TH_1P-P2.54-V-M]  6.85 78.36 0 top
U27  MCP1825S-3302E/DB  [SOT-223-3_L6.5-W3.4-P2.30-LS7.0-BR]  11.05 11.38 90 top
U28  ZX-PZ2.54-1-1PZZ  [HDR-TH_1P-P2.54-V-M]  33.61 78.53 0 top
U29  ZX-PZ2.54-1-1PZZ  [HDR-TH_1P-P2.54-V-M]  33.65 71.12 0 top
U30  ZX-PZ2.54-1-1PZZ  [HDR-TH_1P-P2.54-V-M]  33.6 74.22 0 top
U31  ZX-PZ2.54-1-1PZZ  [HDR-TH_1P-P2.54-V-M]  33.73 67.11 0 top
U32  ZX-PZ2.54-1-1PZZ  [HDR-TH_1P-P2.54-V-M]  33.78 64.13 0 top
U33  ZX-PZ2.54-1-1PZZ  [HDR-TH_1P-P2.54-V-M]  33.77 57.08 0 top
U34  ZX-PZ2.54-1-1PZZ  [HDR-TH_1P-P2.54-V-M]  33.76 60.12 0 top
U35  ZX-PZ2.54-1-1PZZ  [HDR-TH_1P-P2.54-V-M]  33.78 52.83 0 top
U36  -  [Electrode_Contact]  2.23 54.36 270 top
U37  ZX-PZ2.54-1-1PZZ  [HDR-TH_1P-P2.54-V-M]  21.97 78.79 0 top

## Footprints (pads in the part's own frame, mm; a bottom-side part is the same pattern mirrored in y, then rotated)
ADS1198CPAG:QFP50P1200X1200X120-64N
  rect 1.475x0.3 smd: 1(-5.738,3.75) 2(-5.738,3.25) 3(-5.738,2.75) 4(-5.738,2.25) 5(-5.738,1.75) 6(-5.738,1.25) 7(-5.738,0.75) 8(-5.738,0.25) 9(-5.738,-0.25) 10(-5.738,-0.75) 11(-5.738,-1.25) 12(-5.738,-1.75) 13(-5.738,-2.25) 14(-5.738,-2.75) 15(-5.738,-3.25) 16(-5.738,-3.75) 33(5.738,-3.75) 34(5.738,-3.25) 35(5.738,-2.75) 36(5.738,-2.25) 37(5.738,-1.75) 38(5.738,-1.25) 39(5.738,-0.75) 40(5.738,-0.25) 41(5.738,0.25) 42(5.738,0.75) 43(5.738,1.25) 44(5.738,1.75) 45(5.738,2.25) 46(5.738,2.75) 47(5.738,3.25) 48(5.738,3.75)
  rect 0.3x1.475 smd: 17(-3.75,-5.738) 18(-3.25,-5.738) 19(-2.75,-5.738) 20(-2.25,-5.738) 21(-1.75,-5.738) 22(-1.25,-5.738) 23(-0.75,-5.738) 24(-0.25,-5.738) 25(0.25,-5.738) 26(0.75,-5.738) 27(1.25,-5.738) 28(1.75,-5.738) 29(2.25,-5.738) 30(2.75,-5.738) 31(3.25,-5.738) 32(3.75,-5.738) 49(3.75,5.738) 50(3.25,5.738) 51(2.75,5.738) 52(2.25,5.738) 53(1.75,5.738) 54(1.25,5.738) 55(0.75,5.738) 56(0.25,5.738) 57(-0.25,5.738) 58(-0.75,5.738) 59(-1.25,5.738) 60(-1.75,5.738) 61(-2.25,5.738) 62(-2.75,5.738) 63(-3.25,5.738) 64(-3.75,5.738)
BULETM-SMD_ESP32-S3-MINI-1-N8
  rect 0.8x0.4 smd: 1(-6.975,5.95) 2(-6.975,5.1) 3(-6.975,4.25) 4(-6.975,3.4) 5(-6.975,2.55) 6(-6.975,1.7) 7(-6.975,0.85) 8(-6.975,0) 9(-6.975,-0.85) 10(-6.975,-1.7) 11(-6.975,-2.55) 12(-6.975,-3.4) 13(-6.975,-4.25) 14(-6.975,-5.1) 15(-6.975,-5.95) 31(6.975,-5.95) 32(6.975,-5.1) 33(6.975,-4.25) 34(6.975,-3.4) 35(6.975,-2.55) 36(6.975,-1.7) 37(6.975,-0.85) 38(6.975,0) 39(6.975,0.85) 40(6.975,1.7) 41(6.975,2.55) 42(6.975,3.4) 43(6.975,4.25) 44(6.975,5.1) 45(6.975,5.95)
  rect 0.4x0.8 smd: 16(-5.95,-7.025) 17(-5.1,-7.025) 18(-4.25,-7.025) 19(-3.4,-7.025) 20(-2.55,-7.025) 21(-1.7,-7.025) 22(-0.85,-7.025) 23(0,-7.025) 24(0.85,-7.025) 25(1.7,-7.025) 26(2.55,-7.025) 27(3.4,-7.025) 28(4.25,-7.025) 29(5.1,-7.025) 30(5.95,-7.025) 46(5.95,7.025) 47(5.1,7.025) 48(4.25,7.025) 49(3.4,7.025) 50(2.55,7.025) 51(1.7,7.025) 52(0.85,7.025) 53(0,7.025) 54(-0.85,7.025) 55(-1.7,7.025) 56(-2.55,7.025) 57(-3.4,7.025) 58(-4.25,7.025) 59(-5.1,7.025) 60(-5.95,7.025)
  rect 0.8x0.8 smd: GND(-7,7) GND(-7,-7) GND(7,7) GND(7,-7)
  rect 1.2x1.2 smd: GND(-1.65,1.65) GND(-1.65,0) GND(-1.65,-1.65) GND(0,1.65) GND(0,0) GND(0,-1.65) GND(1.65,1.65) GND(1.65,0) GND(1.65,-1.65)
Capacitor_SMD:C_0805_2012Metric
  rrect 1x1.45 smd: 1(-0.95,0) 2(0.95,0)
CONN_2053380000-SD_02_MOL
  rect 1.143x1.498 smd: 1(1,-3.728) 2(-1,-3.728)
  rect 1.397x2.946 smd: 3(-3.895,2.248) 4(3.895,2.248)
Electrode_Contact
  rrect 2.54x3.302 hole 2: 1(0,0)
HDR-TH_1P-P2.54-V-M
  rect 1.7x1.7 hole 1.1: 1(0,0)
HDR-TH_3P-P2.54-V-F
  rect 1.575x1.575 hole 1.02: 1(-2.54,0)
  round 1.575 hole 1.02: 2(0,0) 3(2.54,0)
LED0805-RD_YELLOW
  rect 1x1.25 smd: 1(-1.1,0) 2(1.1,0)
Resistor_SMD:R_0805_2012Metric
  rrect 1.025x1.4 smd: 1(-0.912,0) 2(0.912,0)
SOT-223-3_L6.5-W3.4-P2.30-LS7.0-BR
  rect 2.5x1.1 smd: 1(2.97,-2.3) 2(2.97,0) 3(2.97,2.3)
  rect 2.34x3.6 smd: 4(-2.97,0)
SW-SMD_4P_PTS810SJM250SMTRLFS
  rect 1.2x0.65 smd: 1(-2.078,1.083) 2(2.078,1.075) 3(-2.077,-1.083) 4(2.071,-1.075)

## Nets
GND: BOOT.1 BOOT.2 C1.2 C2.2 C3.2 C4.2 C6.1 C7.2 C8.2 C9.1 C10.2 C11.2 C12.2 C13.2 C14.2 C15.2 C16.2 C17.2 C18.1 C19.2 C20.2 C21.2 C22.2 C23.2 C24.2 C25.2 C26.2 C27.2 C28.2 C29.2 C31.2 C32.2 C35.2 C36.2 H2.1 IC2.20 IC2.23 IC2.25 IC2.31 IC2.32 IC2.33 IC2.39 IC2.41 IC2.49 IC2.51 IC2.53 IC2.57 IC2.58 R42.2 R44.2 RESET.3 RESET.4 U20.2 U22.1 U22.2 U22.42 U22.43 U22.46 U22.47 U22.48 U22.49 U22.50 U22.51 U22.52 U22.53 U22.54 U22.55 U22.56 U22.57 U22.58 U22.59 U22.60 U22.GND U27.2 U27.4
VBAT: C36.1 U20.1 U27.1
1N: R34.1 U3.1 U5.1
1N_F: C25.1 IC2.15 R34.2
1P: R1.1 U1.1 U36.1
1P_F: C24.1 IC2.16 R1.2
2N: R36.1 U4.1 U7.1
2N_F: C27.1 IC2.13 R36.2
2P: R35.1 U2.1 U6.1
2P_F: C26.1 IC2.14 R35.2
3N: R3.1 U9.1 U25.1
3N_F: C2.1 IC2.11 R3.2
3P: R2.1 U8.1 U23.1
3P_F: C1.1 IC2.12 R2.2
4N: R5.1 U11.1 U26.1
4N_F: C13.1 IC2.9 R5.2
4P: R4.1 U10.1 U24.1
4P_F: C4.1 IC2.10 R4.2
5N: R8.1 U13.1 U30.1
5N_F: C15.1 IC2.7 R8.2
5P: R6.1 U12.1 U28.1
5P_F: C14.1 IC2.8 R6.2
6N: R10.1 U15.1 U31.1
6N_F: C17.1 IC2.5 R10.2
6P: R9.1 U14.1 U29.1
6P_F: C16.1 IC2.6 R9.2
7N: R12.1 U17.1 U34.1
7N_F: C21.1 IC2.3 R12.2
7P: R11.1 U16.1 U32.1
7P_F: C19.1 IC2.4 R11.2
8N: R14.1 U19.1 U35.1
8N_F: C32.1 IC2.1 R14.2
8P: R13.1 U18.1 U33.1
8P_F: C31.1 IC2.2 R13.2
DIN: IC2.34 U22.15
DOUT: IC2.43 U22.17
DRDY_: IC2.47 U22.13
ESP32_EN: C20.1 R22.2 RESET.1 RESET.2 U22.45
LED: LED3.2 U22.19
POWER_+3.3V: C3.1 C23.1 C28.1 C29.1 C35.1 IC2.17 IC2.18 IC2.19 IC2.21 IC2.22 IC2.35 IC2.38 IC2.48 IC2.50 IC2.52 IC2.54 IC2.56 IC2.59 IC2.62 LED2.2 R22.1 R26.1 U22.3 U27.3
REF: R37.1 U21.1 U37.1
RESET_: IC2.36 U22.12
RLDINV: C5.2 IC2.61 R7.2
RLDOUT: C5.1 IC2.63 R7.1 R37.2
SCLK: IC2.40 U22.16
USB_N: H2.3 U22.23
USB_P: H2.2 U22.24
VREFP: C7.1 C8.1 IC2.24
$1N2733: C12.1 IC2.30
$1N2742: C11.1 IC2.28
$1N2744: C9.2 C18.2 IC2.55
$1N2800: C6.2 IC2.64
$1N2847: C10.1 IC2.26
$1N15781: BOOT.3 BOOT.4 C22.1 U22.4
$1N16915: R26.2 U22.22
$1N37471: LED3.1 R42.1
$1N37498: LED2.1 R44.1

Pads without a net: IC2 27 29 37 42 44 45 46 60; U20 3 4; U22 5 6 7 8 9 10 11 14 18 20 21 25 26 27 28 29 30 31 32 33 34 35 36 37 38 39 40 41 44

## Via types
v1: diameter 0.61, hole 0.305, Top Layer to Bottom Layer, 65 vias

## Routing (per net, layer and track width the routed paths; a pad name or vN(x,y) marks a point on that pad's centre or on a via; arc(x,y) is an arc through that point)
GND: length 129.6
  Top Layer w0.254: C14.2 29.94,79.02 v1(29.92,79) ; IC2.53 v1(24.01,39.12) ; v1(15.37,21.61) 15.37,22.22 U20.2 ; v1(9.85,34.17) C12.2 C11.2 C10.2 C8.2 C7.2 ; IC2.58 IC2.57 23.52,41.12 v1(23.23,41.41) ; U22.GND U22.GND ; U22.GND U22.GND U22.GND U22.GND ; U22.GND U22.GND U22.GND ; U22.GND U22.GND U22.GND ; U22.GND v1(25.16,9.76) ; 9.53,66.57 9.53,64.79 9.77,65.03 v1(10.41,65.03) ; v1(30.1,27.69) 31.44,27.69 R44.2 ; v1(29.92,52.33) 29.94,52.35 C32.2 ; v1(10.61,18.41) C35.2 11.05,16.52 U27.2 ; IC2.33 16.05,35.16 v1(15.25,35.16) ; RESET.4 24.56,22.26 RESET.3 27.7,22.27 C20.2 v1(27.81,23.24) ; 24.55,1.11 U22.GND 34.92,1.13 U22.1 U22.2 ; 24.55,1.11 U22.49 ; 24.55,1.11 24.55,2.24 v1(24.52,2.26) ; 24.55,1.11 U22.GND ; C15.2 C16.2 29.98,71.9 v1(29.92,71.96) ; v1(14.61,1.27) 15.81,1.27 C3.2 C23.2 ; C36.2 v1(15.75,16.93) ; 9.53,57.68 9.53,59.46 9.64,59.57 v1(10.47,59.57) ; v1(10.47,79.12) 9.64,79.12 9.53,79.02 ; IC2.41 20.07,36.18 v1(19.44,36.81) 19.07,36.44 IC2.39 ; v1(30.1,23.37) 31.41,23.37 R42.2 ; v1(10.47,52.45) 9.64,52.45 9.53,52.35 ; v1(22.11,4.71) U22.42 U22.43 ; v1(10.47,73.79) 10.45,73.81 C4.2 C2.2 ; v1(27.7,28.71) C22.2 27.57,27.6 BOOT.2 24.56,27.6 BOOT.1 20.36,27.56 v1(19.05,27.56) ; U27.4 13.55,8.41 v1(13.59,8.46) ; IC2.51 v1(24.01,38.12) ; v1(29.92,59.41) 29.96,59.46 C21.2 C31.2 ; v1(14.08,36.43) IC2.32 IC2.31 ; v1(29.92,64.77) 29.94,64.79 C19.2 C17.2 ; IC2.20 v1(15.76,43.12) ; C9.1 C18.1 C28.2 C29.2 30.09,35.87 v1(30.09,34.55) ; C6.1 v1(27.04,48.17) ; U22.GND v1(22.36,13.69) ; H2.1 v1(5.08,2.03) ; IC2.49 24.07,37.12 v1(24.01,37.06) ; IC2.23 15.26,41.62 v1(15.76,41.13) 15.25,40.62 IC2.25 ; v1(34.92,16.39) 34.92,15.14 U22.GND
VBAT: length 11.9
  Top Layer w0.508: U20.1 12.47,22.88 C36.1 ; 12.72,16.93 12.6,16.81 ; U27.1 13.39,14.38 13.39,14.93 12.53,15.79 12.53,16.74
1N: length 11.5
  Top Layer w0.254: 7.49,54.76 4.54,54.76 2.35,56.96 2.35,57.28 ; 7.49,54.76 6.72,55.53 U3.1 ; 7.49,54.76 8.28,54.76 R34.1 ; 2.35,57.28 2.47,57.28 ; 2.35,57.28 2.22,57.28 ; 2.28,57.47 U5.1
1N_F: length 14.2
  Top Layer w0.254: 11.37,55.9 11.43,55.96 11.43,57.68 ; 11.75,55.9 12.12,55.53 14,55.53 14.88,54.65 14.88,49.25 16.57,47.56 IC2.15
1P: length 11.3
  Top Layer w0.254: R1.1 7.79,52.5 U1.1 ; 9.92,54.12 9.69,54.36 U36.1
1P_F: length 14.1
  Top Layer w0.254: 11.43,52.35 11.37,52.41 11.37,54.12 ; IC2.16 16.07,47.43 14.47,49.03 14.47,54.49 13.84,55.12 12.75,55.12 11.75,54.12 11.75,54.44
2N: length 10.9
  Top Layer w0.254: 7.06,61.9 4.33,61.9 2.34,63.88 ; 7.06,61.9 6.72,62.23 U4.1 ; 7.06,61.9 8.45,61.9 9.54,62.99 9.9,62.99 9.92,63.01
2N_F: length 23.3
  Top Layer w0.254: 11.75,63.01 12.16,63.43 15.38,63.43 16.3,62.5 16.3,49.68 17.57,48.4 IC2.13 ; 11.37,63.01 11.37,64.73 11.43,64.79
2P: length 11.1
  Top Layer w0.254: R35.1 9.45,61.27 9.23,61.49 5.54,61.49 ; 5.54,61.49 1.79,61.49 1.26,60.96 1.26,60.71 ; 5.54,61.49 6.73,60.3 U2.1
2P_F: length 23.2
  Top Layer w0.254: 11.75,61.24 13.51,63 15.23,63 15.89,62.34 15.89,49.51 17.07,48.33 IC2.14 ; 11.43,59.46 11.37,59.52 11.37,61.24
3N: length 10.6
  Top Layer w0.254: U25.1 6.89,70.08 7.73,69.24 ; 7.73,69.24 8.4,69.24 9.14,69.98 9.77,69.98 9.92,70.13 ; 7.73,69.24 3.32,69.24 2.33,70.23
3N_F: length 31.1
  Top Layer w0.254: IC2.11 18.54,46.65 18.54,49.41 17.7,50.25 17.7,69.23 16.92,70.01 11.87,70.01 11.75,70.13 ; 11.43,71.9 11.43,70.19 11.37,70.13
3P: length 10.6
  Top Layer w0.254: 7.61,68.83 6.77,67.99 U23.1 ; 7.61,68.83 9.06,68.83 9.54,68.35 ; 7.61,68.83 3.73,68.83 2.34,67.44 2.34,67.06
3P_F: length 31.2
  Top Layer w0.254: 11.75,68.67 11.75,68.35 12.07,68.35 13.32,69.6 16.75,69.6 17.29,69.06 17.29,50.02 18.07,49.24 IC2.12 ; 11.37,68.35 11.43,68.29 11.43,66.57
4N: length 12.6
  Top Layer w0.254: U26.1 6.92,78.36 8.65,76.63 8.65,76.57 ; 8.65,76.57 5.06,76.57 3.6,75.1 2.91,75.1 2.32,75.69 2.32,76.58 ; 8.65,76.57 9.89,76.57 9.92,76.6 9.92,77.24
4N_F: length 38.4
  Top Layer w0.254: 11.43,79.02 11.37,78.95 11.37,77.24 ; IC2.9 19.57,50.78 19.07,51.29 19.07,74.14 15.63,77.58 12.09,77.58 11.75,77.24
4P: length 12.5
  Top Layer w0.254: 8.53,76.07 5.14,76.07 2.99,73.92 1.8,73.92 1.3,73.41 ; 8.53,76.07 9.31,76.07 9.92,75.46 ; 8.53,76.07 6.85,74.4 U24.1
4P_F: length 38.6
  Top Layer w0.254: 11.43,73.68 11.43,75.4 11.37,75.46 ; IC2.10 19.07,50.65 18.66,51.06 18.66,73.91 15.4,77.17 13.78,77.17 12.07,75.46 11.75,75.46 11.75,75.78
5N: length 10.8
  Top Layer w0.254: R8.1 31.53,76.19 34.22,76.19 ; 34.22,76.19 33.6,75.56 U30.1 ; 34.22,76.19 34.81,76.19 37.58,73.41 U13.1
5N_F: length 39
  Top Layer w0.254: C15.1 28.96,75.45 R8.2 28.66,75.46 27.28,76.83 23.9,76.83 21.46,74.38 21.46,51.69 20.57,50.81 IC2.7
5P: length 10.8
  Top Layer w0.254: U12.1 34.98,76.58 34.98,76.59 31.45,76.59 R6.1 32.1,78.53 U28.1
5P_F: length 39.2
  Top Layer w0.254: C14.1 28.96,77.25 R6.2 23.68,77.24 21.05,74.61 21.05,51.92 20.07,50.94 IC2.8
6N: length 11.7
  Top Layer w0.254: 37.83,67.07 36.06,68.83 32,68.83 31.62,68.45 30.84,68.45 30.54,68.15 ; U31.1 32.32,67.11 31.09,68.35 R10.1
6N_F: length 30.9
  Top Layer w0.254: C17.1 28.96,68.34 R10.2 28.55,68.35 27.18,69.72 25.07,69.72 22.85,67.5 22.85,50.99 21.5,49.64 21.5,46.68 IC2.5
6P: length 11.5
  Top Layer w0.254: 37.08,69.47 37.84,70.23 37.84,69.3 ; 37.08,69.47 37.46,69.47 ; 37.08,69.47 36.84,69.24 32.48,69.24 ; R9.1 31.69,69.24 32.48,69.24 ; U29.1 33.65,70.41 32.48,69.24
6P_F: length 31
  Top Layer w0.254: IC2.6 21.07,49.78 22.45,51.16 22.45,67.67 24.9,70.13 R9.2 28.96,70.14 C16.1
7N: length 10.4
  Top Layer w0.254: 30.87,61.24 31.39,61.24 32.23,62.08 32.76,62.08 ; 32.76,62.08 35.84,62.08 37.21,60.71 U17.1 ; 32.76,62.08 33.76,61.07 U34.1
7N_F: length 23.6
  Top Layer w0.254: IC2.3 22.57,48.36 24.35,50.14 24.35,61.83 25.52,63 26.78,63 28.54,61.24 R12.2 28.96,61.22 C21.1
7P: length 10.2
  Top Layer w0.254: 37.83,63.89 36.42,62.48 32.15,62.48 ; 32.15,62.48 32.15,62.51 U32.1 ; 32.15,62.48 31.33,62.48 R11.1
7P_F: length 23.7
  Top Layer w0.254: C19.1 28.96,63.03 R11.2 28.55,63.01 28.16,63.4 25.35,63.4 23.95,62 23.95,50.31 22.17,48.53 22.17,48.47 22.07,48.37 IC2.4
8N: length 11
  Top Layer w0.254: U35.1 33.78,53.09 32.74,54.12 R14.1 31.29,54.61 37.56,54.61 37.81,54.36
8N_F: length 14.5
  Top Layer w0.254: IC2.1 23.57,47.33 25.8,49.56 25.8,54.38 26.41,54.99 28.42,54.99 28.97,54.44 R14.2 28.96,54.11 C32.1
8P: length 11.2
  Top Layer w0.254: 32.16,55.02 33.77,56.64 U33.1 ; 32.16,55.02 34.7,55.02 37.21,57.53 37.82,57.53 ; 32.16,55.02 31.68,55.02 R13.1
8P_F: length 14.3
  Top Layer w0.254: 28.47,55.9 26.74,55.9 25.39,54.55 25.39,49.79 23.07,47.47 IC2.2 ; R13.2 28.96,55.91 C31.1
DIN: length 38.6
  Top Layer w0.254: U22.15 35.9,14.06 36.2,14.35 36.2,28.19 31.37,33.02 v1(23.11,33.02) ; 34.82,14.08 34.8,14.06 ; v1(16.63,33.66) 16.63,35.08 IC2.34
  Bottom Layer w0.254: v1(23.11,33.02) 17.27,33.02 v1(16.63,33.66)
DOUT: length 32.1
  Top Layer w0.254: IC2.43 21.07,33.16 22.48,31.75 31.37,31.75 35.43,27.69 35.43,20.19 33.05,17.81 U22.17
DRDY_: length 34
  Top Layer w0.254: U22.13 35.81,12.36 36.58,13.12 36.58,28.37 31.42,33.53 23.88,33.53 23.14,34.26 23.14,35.06 IC2.47
ESP32_EN: length 31.3
  Top Layer w0.254: RESET.1 24.56,20.11 RESET.2 ; RESET.1 27.65,20.1 ; RESET.1 24.57,18.82 22.23,16.49 20.33,16.49 19.43,15.59 19.43,3.16 20.44,2.16 20.85,2.16 ; R22.2 26.68,19.13 27.65,20.1 ; 27.65,20.1 C20.1
LED: length 5.8
  Top Layer w0.254: 31.22,20.87 31.35,20.73 U22.19
POWER_+3.3V: length 37.9
  Top Layer w0.254: v1(24.01,43.67) 25.52,43.67 IC2.62 ; IC2.38 18.57,36.03 v1(17.79,36.81) 17.07,36.09 IC2.35 ; IC2.19 IC2.18 IC2.17 v1(14.08,45.32) ; IC2.21 IC2.22 v1(15.76,42.12) ; IC2.52 27.22,38.62 C28.1 ; C28.1 26.42,37.7 26.41,37.69 25.63,37.69 IC2.50 ; C28.1 C29.1 28.19,35.87 v1(28.19,34.55) ; IC2.56 24.1,40.62 v1(24.01,40.54) 24.54,40.01 24.54,39.86 24.8,39.6 25.54,39.6 IC2.54 ; IC2.59 v1(24.01,42.12) ; v1(15.88,4.44) C3.1 C23.1 ; IC2.48 v1(24.39,35.13) ; 8.71,14.4 U27.3
  Top Layer w0.508: 8.71,16.97 8.71,14.4 ; v1(7.11,14.22) 8.63,14.22 U27.3 ; U22.3 33.86,3.86 v1(33.79,3.79) ; v1(25.01,16.77) 26.6,16.77 R22.1 ; R26.1 28.71,18.8 v1(30.49,18.8) ; v1(30.1,25.4) 31.13,25.4 LED2.2
REF: length 42.7
  Top Layer w0.254: U21.1 20.03,80.73 U37.1 ; R37.1 30.21,48.13 v1(29.35,49)
  Bottom Layer w0.254: U21.1 20.08,82.09 20.08,58.03 29.1,49 v1(29.35,49)
RESET_: length 42
  Top Layer w0.254: v1(18.28,32.37) 17.57,33.08 IC2.36 ; U22.12 34.93,11.5 35.82,11.5 36.96,12.63 36.96,28.82 v1(33.33,32.45)
  Bottom Layer w0.254: v1(33.33,32.45) 33.25,32.37 v1(18.28,32.37)
RLDINV: length 4.9
  Top Layer w0.254: C5.2 28.37,42.97 R7.2 28.14,43.19 25.63,43.19 IC2.61
RLDOUT: length 6.6
  Top Layer w0.254: R37.2 C5.1 30.33,44.83 R7.1 27.62,44.12 IC2.63
SCLK: length 33.9
  Top Layer w0.254: v1(21.83,33.6) 21.83,33.29 22.86,32.26 31.5,32.26 35.79,27.96 35.79,20.05 33.9,18.16 U22.16 ; v1(19.55,33.66) 19.55,35.11 IC2.40
  Bottom Layer w0.254: v1(21.83,33.6) 19.61,33.6 v1(19.55,33.66)
USB_N: length 24.6
  Top Layer w0.261: v1(22.87,9.22) 23.28,9.62 23.28,9.87 26.79,13.37 27.3,13.37 27.73,13.8 27.73,14.24 27.95,14.46 U22.23 ; H2.3 11.38,3.09 11.38,3.36 11.43,3.41 11.43,4.12 11.62,4.31 11.87,4.31 v1(12.28,4.71)
  Bottom Layer w0.261: v1(12.28,4.71) 12.68,5.12 12.68,5.37 12.87,5.55 18.97,5.55 22.22,8.81 22.47,8.81 v1(22.87,9.22)
USB_P: length 24.6
  Top Layer w0.261: H2.2 10.97,3.09 10.97,3.53 11.02,3.59 11.02,4.29 11.33,4.6 11.33,4.85 v1(11.74,5.25) ; v1(22.33,9.75) 22.74,10.16 22.99,10.16 26.61,13.79 27.13,13.79 27.32,13.98 27.32,14.24 27.1,14.46 U22.24
  Bottom Layer w0.261: v1(11.74,5.25) 12.14,5.66 12.39,5.66 12.7,5.97 18.8,5.97 21.93,9.1 21.93,9.35 v1(22.33,9.75)
VREFP: length 4.1
  Top Layer w0.254: C7.1 C8.1 14.08,41.13 IC2.24
$1N2733: length 3.8
  Top Layer w0.254: C12.1 13.07,37.1 13.07,37.89 13.23,38.05 14.01,38.05 14.08,38.12
$1N2742: length 3
  Top Layer w0.254: IC2.28 13.31,39.12 13.24,39.05 13.23,39.05 13.07,38.89 13.07,38.88 C11.1
$1N2744: length 4.8
  Top Layer w0.254: C18.2 C9.2 27.01,40.12 IC2.55
$1N2800: length 3.5
  Top Layer w0.254: C6.2 27.68,45.62 27.66,45.62 27.35,45.31 27.35,45.29 26.68,44.62 IC2.64
$1N2847: length 2.6
  Top Layer w0.254: IC2.26 14.01,40.05 13.23,40.05 12.53,39.35 C10.1
$1N15781: length 32.3
  Top Layer w0.254: 34.8,4.71 34.77,4.68 v1(33.79,4.68) ; BOOT.3 20.42,25.45 BOOT.4 27.57,25.45 C22.1 27.86,25.4 v1(28.82,25.4)
  Bottom Layer w0.254: v1(28.82,25.4) 28.82,22.74 29.52,22.05 29.52,13.03 33.79,8.75 v1(33.79,4.68)
$1N16915: length 1.8
  Top Layer w0.254: U22.22 28.8,16.63 R26.2
$1N37471: length 2.5
  Top Layer w0.254: R42.1 33.42,23.19 33.42,20.87
$1N37498: length 2
  Top Layer w0.254: 33.3,27.47 33.3,25.75 LED2.1

## Copper pours and planes (outline as drawn; the poured copper is in the pictures)
GND on Inner1: 0.26,84.2 40,84.2 40,0.26 0.26,0.26
POWER_+3.3V on Inner2: 0.26,84.2 40,84.2 40,0.26 0.26,0.26

Small or netless copper shapes (teardrops, artwork), in the pictures only: 205 on Top Layer, 1 on Bottom Layer, 4 on Inner1

## Text on the board
Top Silkscreen Layer: GND | P | N | Final Year Project 2026 | Imperial College London | - E3 + | - E2 + | - E1 + | - E4 + | BATTERY | REF | - E6 + | - E7 + | - E8 + | - E5 + | Knitted EMG | Abby Finka
